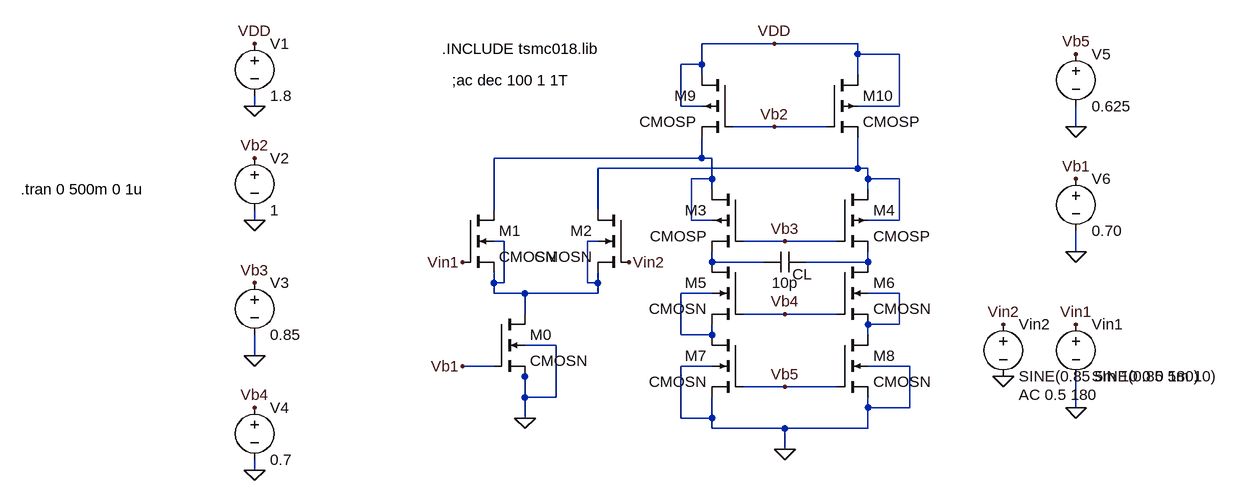
[diagram p0: schematic exp 8.asc]
exp 8.asc, the LTspice schematic file:
Version 4
SHEET 1 880 680
WIRE 160 -96 48 -96
WIRE 288 -96 160 -96
WIRE 288 -80 288 -96
WIRE 352 -80 288 -80
WIRE 48 -64 48 -96
WIRE 48 -64 16 -64
WIRE 48 -48 48 -64
WIRE 288 -48 288 -80
WIRE -640 0 -640 -16
WIRE 16 0 16 -64
WIRE 48 0 16 0
WIRE 352 0 352 -80
WIRE 352 0 288 0
WIRE 160 32 96 32
WIRE 240 32 160 32
WIRE 624 32 624 0
WIRE 48 80 48 48
WIRE 48 80 -272 80
WIRE 64 80 48 80
WIRE 288 96 288 48
WIRE 288 96 -112 96
WIRE 304 96 288 96
WIRE 64 112 64 80
WIRE 64 112 32 112
WIRE 304 112 304 96
WIRE 352 112 304 112
WIRE 64 128 64 112
WIRE 304 128 304 112
WIRE -272 160 -272 80
WIRE -112 160 -112 96
WIRE -640 176 -640 160
WIRE 32 176 32 112
WIRE 64 176 32 176
WIRE 352 176 352 112
WIRE 352 176 304 176
WIRE -256 208 -272 208
WIRE -112 208 -128 208
WIRE 176 208 112 208
WIRE 256 208 176 208
WIRE 624 224 624 192
WIRE 64 240 64 224
WIRE 144 240 64 240
WIRE 304 240 304 224
WIRE 304 240 208 240
WIRE -272 272 -272 256
WIRE -256 272 -256 208
WIRE -256 272 -272 272
WIRE -128 272 -128 208
WIRE -112 272 -112 256
WIRE -112 272 -128 272
WIRE -272 288 -272 272
WIRE -224 288 -272 288
WIRE -112 288 -112 272
WIRE -112 288 -224 288
WIRE 64 288 16 288
WIRE 352 288 304 288
WIRE -224 320 -224 288
WIRE 176 320 112 320
WIRE 256 320 176 320
WIRE 352 336 352 288
WIRE 352 336 304 336
WIRE 16 352 16 288
WIRE 64 352 64 336
WIRE 64 352 16 352
WIRE 304 352 304 336
WIRE -176 368 -224 368
WIRE -640 384 -640 352
WIRE -272 400 -320 400
WIRE 64 400 16 400
WIRE 368 400 304 400
WIRE -224 416 -224 400
WIRE 176 432 112 432
WIRE 256 432 176 432
WIRE -224 448 -224 416
WIRE -176 448 -176 368
WIRE -176 448 -224 448
WIRE 304 464 304 448
WIRE 368 464 368 400
WIRE 368 464 304 464
WIRE 624 464 624 416
WIRE -224 480 -224 448
WIRE 16 480 16 400
WIRE 64 480 64 448
WIRE 64 480 16 480
WIRE 64 496 64 480
WIRE 176 496 64 496
WIRE 304 496 304 464
WIRE 304 496 176 496
WIRE 176 528 176 496
WIRE -640 560 -640 544
FLAG -224 480 0
FLAG 176 528 0
FLAG -640 0 0
FLAG -640 176 0
FLAG -640 384 0
FLAG -640 560 0
FLAG 624 32 0
FLAG 624 224 0
FLAG 624 464 0
FLAG -640 -96 VDD
FLAG 160 -96 VDD
FLAG -640 80 Vb2
FLAG 160 32 Vb2
FLAG -640 272 Vb3
FLAG 176 208 Vb3
FLAG -640 464 Vb4
FLAG 176 320 Vb4
FLAG 176 432 Vb5
FLAG 624 -80 Vb5
FLAG -320 400 Vb1
FLAG 624 112 Vb1
FLAG 624 336 Vin1
FLAG -320 240 Vin1
FLAG 512 416 0
FLAG 512 336 Vin2
FLAG -64 240 Vin2
SYMBOL cmosp 240 -48 R0
SYMATTR InstName M10
SYMATTR Value2 l=720n w=4720n
SYMBOL cmosp 256 128 R0
SYMATTR InstName M4
SYMATTR Value2 l=180n w=1030n
SYMBOL cmosp 96 -48 M0
SYMATTR InstName M9
SYMATTR Value2 l=720n w=4720n
SYMBOL cmosp 112 128 M0
SYMATTR InstName M3
SYMATTR Value2 l=180n w=1030n
SYMBOL cmosn 256 240 R0
SYMATTR InstName M6
SYMATTR Value2 l=360n w=1090n
SYMBOL cmosn 256 352 R0
SYMATTR InstName M8
SYMATTR Value2 l=180n w=545n
SYMBOL cmosn -320 160 R0
SYMATTR InstName M1
SYMATTR Value2 l=1440n w=13320n
SYMBOL cmosn -272 320 R0
SYMATTR InstName M0
SYMATTR Value2 l=180n w=534n
SYMBOL cmosn -64 160 M0
SYMATTR InstName M2
SYMATTR Value2 l=1440n w=13320n
SYMBOL cmosn 112 240 M0
SYMATTR InstName M5
SYMATTR Value2 l=360n w=1090n
SYMBOL cmosn 112 352 M0
SYMATTR InstName M7
SYMATTR Value2 l=180n w=545n
SYMBOL voltage -640 -112 R0
WINDOW 123 0 0 Left 2
WINDOW 39 0 0 Left 2
SYMATTR InstName V1
SYMATTR Value 1.8
SYMBOL voltage -640 64 R0
WINDOW 123 0 0 Left 2
WINDOW 39 0 0 Left 2
SYMATTR InstName V2
SYMATTR Value 1
SYMBOL voltage -640 256 R0
WINDOW 123 0 0 Left 2
WINDOW 39 0 0 Left 2
SYMATTR InstName V3
SYMATTR Value 0.85
SYMBOL voltage -640 448 R0
WINDOW 123 0 0 Left 2
WINDOW 39 0 0 Left 2
SYMATTR InstName V4
SYMATTR Value 0.7
SYMBOL voltage 624 -96 R0
WINDOW 123 0 0 Left 2
WINDOW 39 0 0 Left 2
SYMATTR InstName V5
SYMATTR Value 0.625
SYMBOL voltage 624 96 R0
WINDOW 123 0 0 Left 2
WINDOW 39 0 0 Left 2
SYMATTR InstName V6
SYMATTR Value 0.70
SYMBOL voltage 624 320 R0
WINDOW 123 24 124 Left 2
WINDOW 39 0 0 Left 2
SYMATTR InstName Vin1
SYMATTR Value SINE(0.85 5m 10)
SYMBOL cap 208 224 R90
WINDOW 0 50 5 VBottom 2
WINDOW 3 32 32 VTop 2
SYMATTR InstName CL
SYMATTR Value 10p
SYMBOL voltage 512 320 R0
WINDOW 123 24 124 Left 2
WINDOW 39 0 0 Left 2
SYMATTR Value2 AC 0.5 180
SYMATTR InstName Vin2
SYMATTR Value SINE(0.85 5m 10 0 0 180)
TEXT -336 -40 Left 2 !;ac dec 100 1 1T
TEXT -352 -88 Left 2 !.INCLUDE tsmc018.lib
TEXT -1000 128 Left 2 !.tran 0 500m 0 1u

The netlist it stands for:
* exp 8.asc
M10 VDD Vb2 N002 VDD CMOSP l=720n w=4720n
M4 N002 Vb3 N005 N002 CMOSP l=180n w=1030n
M9 VDD Vb2 N001 VDD CMOSP l=720n w=4720n
M3 N001 Vb3 N004 N001 CMOSP l=180n w=1030n
M6 N005 Vb4 N007 N007 CMOSN l=360n w=1090n
M8 N007 Vb5 0 0 CMOSN l=180n w=545n
M1 N001 Vin1 N003 N003 CMOSN l=1440n w=13320n
M0 N003 Vb1 0 0 CMOSN l=180n w=534n
M2 N002 Vin2 N003 N003 CMOSN l=1440n w=13320n
M5 N004 Vb4 N006 N006 CMOSN l=360n w=1090n
M7 N006 Vb5 0 0 CMOSN l=180n w=545n
V1 VDD 0 1.8
V2 Vb2 0 1
V3 Vb3 0 0.85
V4 Vb4 0 0.7
V5 Vb5 0 0.625
V6 Vb1 0 0.70
Vin1 Vin1 0 SINE(0.85 5m 10)
CL N005 N004 10p
Vin2 Vin2 0 SINE(0.85 5m 10 0 0 180) AC 0.5 180
.model NMOS NMOS
.model PMOS PMOS
.lib standard.mos
;ac dec 100 1 1T
.INCLUDE tsmc018.lib
.tran 0 500m 0 1u
.backanno
.end